# EAGLE design DotControl (EAGLE 7.7.0)

## Sheet 1 of 2
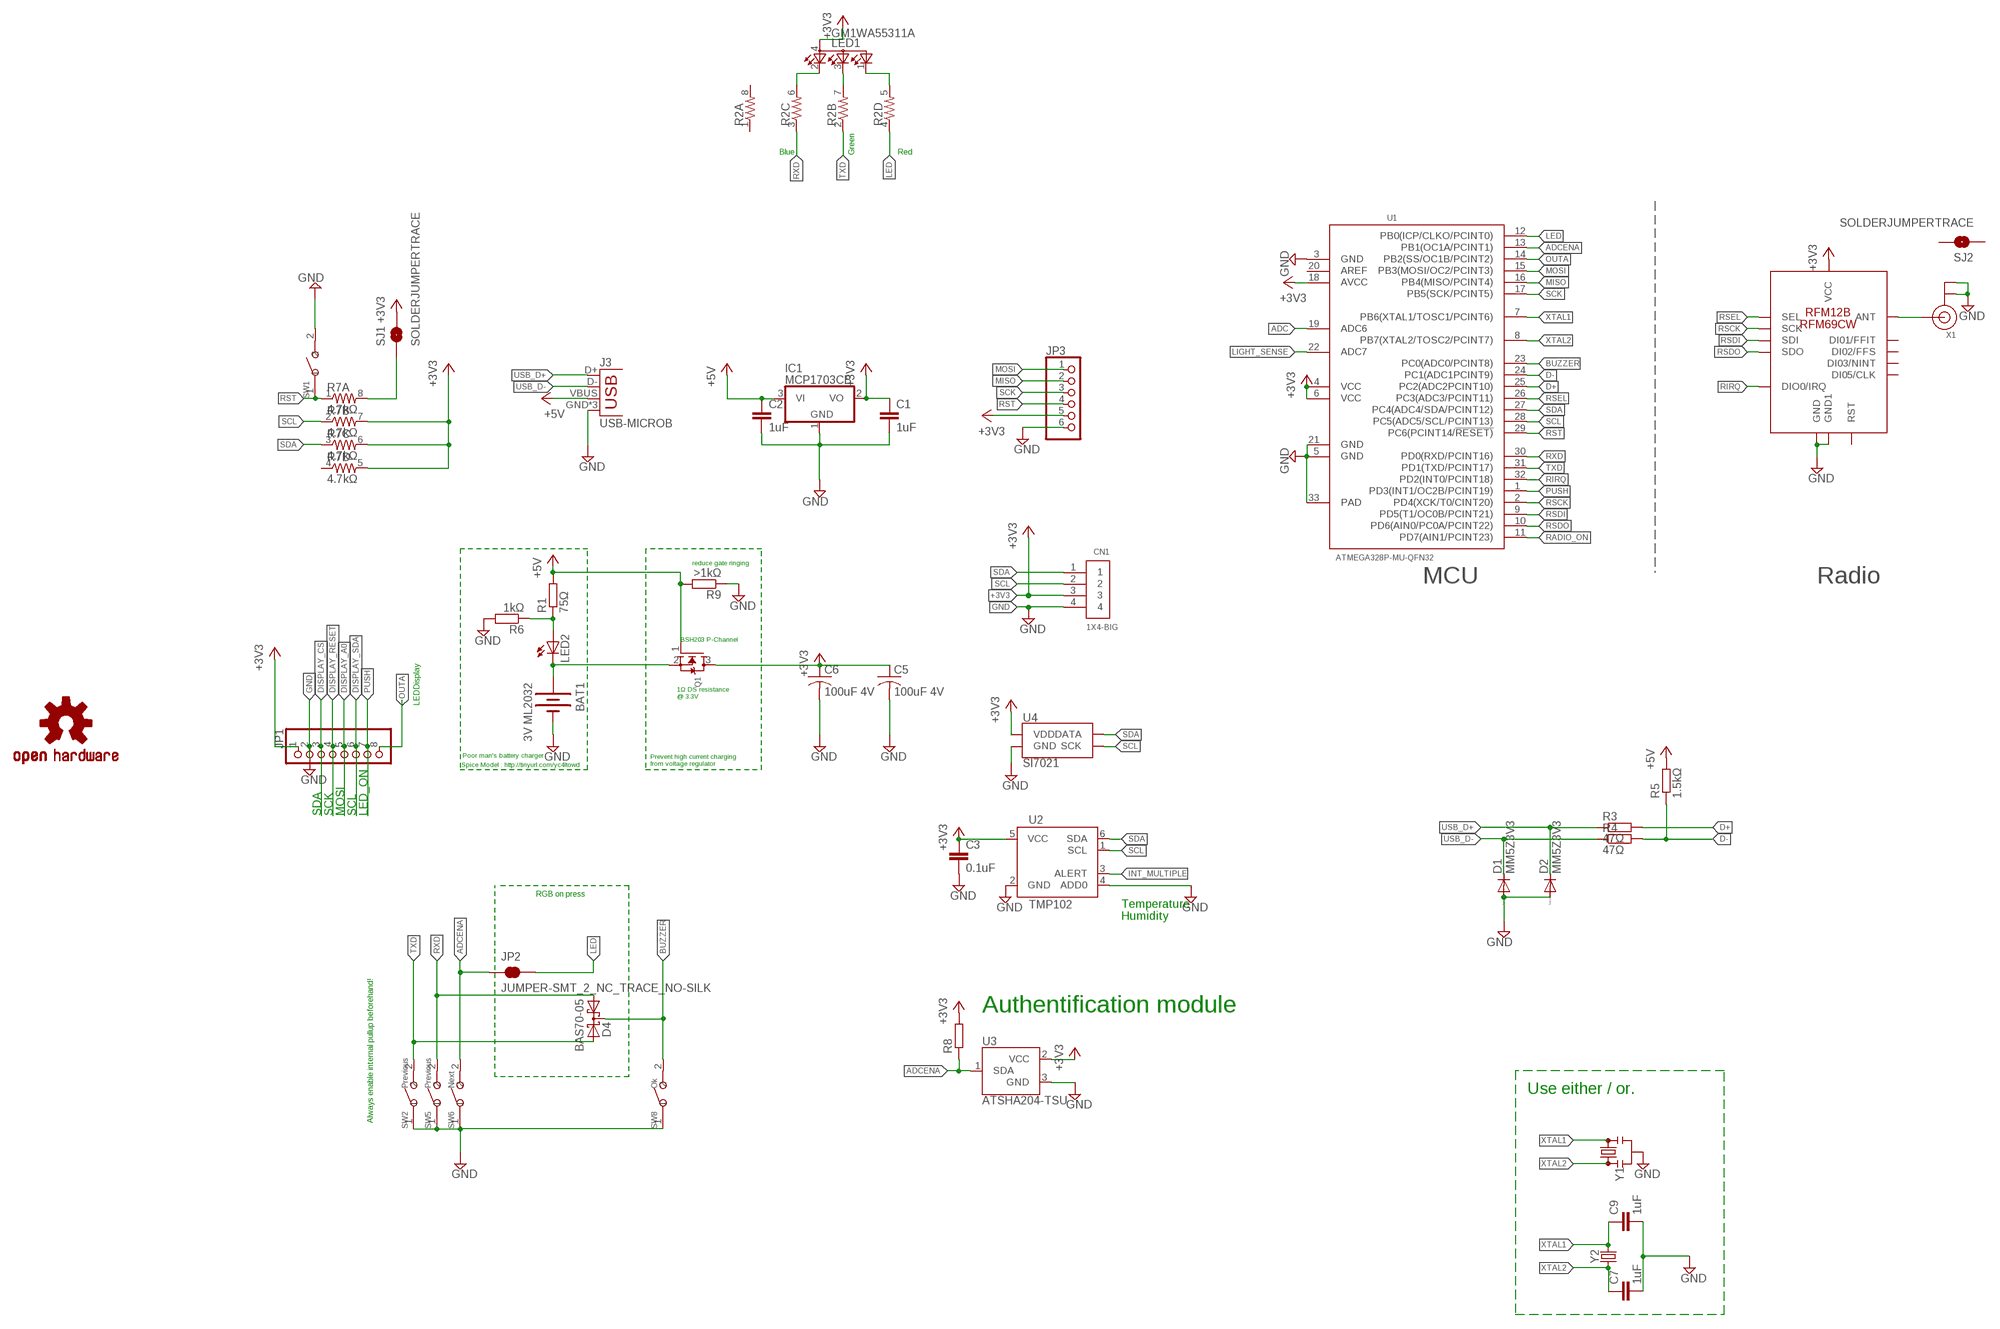
[diagram p0: schematic, sheet 1, part 1 of 2]
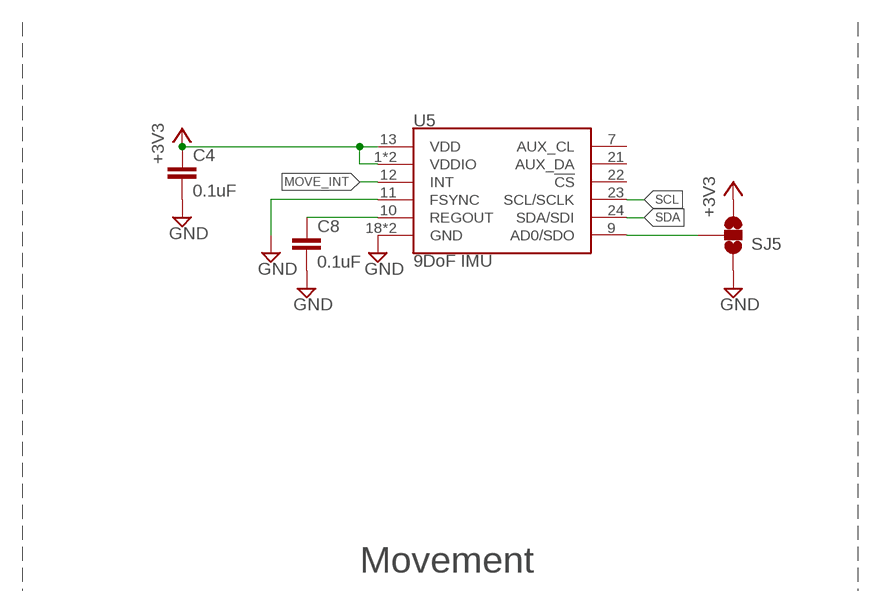
[diagram p1: schematic, sheet 1, part 2 of 2]

### Parts
BAT1  3V ML2032  BATTERY20PTH  [BATTCOM_20MM_PTH]
C1  1uF  C-EUC0603  [C0603]
C2  1uF  C-EUC0603  [C0603]
C3  0.1uF  C-EUC0603  [C0603]
C4  0.1uF  C-EUC0603  [C0603]
C5  100uF 4V  C-USC3216  [C3216]
C6  100uF 4V  C-USC3216  [C3216]
C7  1uF  C-EUC0603  [C0603]
C8  0.1uF  C-EUC0603  [C0603]
C9  1uF  C-EUC0603  [C0603]
CN1  1X4-BIG  [1X04-BIG]
D1  MM5Z3V3  DIODE-SOD523  [SOD523]
D2  MM5Z3V3  DIODE-SOD523  [SOD523]
D4  BAS70-05  [SOT23]
IC1  MCP1703CB  [SOT23]
J3  USB-MICROB  [USB-MICROB]
JP1  PINHD-1X8CLEANBIG  [1X08-CLEANBIG]
JP2  JUMPER-SMT_2_NC_TRACE_NO-SILK  [SMT-JUMPER_2_NC_TRACE_NO-SILK]
JP3  PINHD-1X6  [1X06]
LED1  GM1WA55311A  [GM1WA55311A]
LED2  LED0603  [LED-0603]
Q1  MOSFET-NREFLOW  [SOT23]
R1  75Ω  R-EU_R0603  [R0603]
R2  RESISTOR-ARRAY0603-ARV  [0603-ARV]
R3  47Ω  R-EU_R0603  [R0603]
R4  47Ω  R-EU_R0603  [R0603]
R5  1.5kΩ  R-EU_R0603  [R0603]
R6  1kΩ  R-EU_R0603  [R0603]
R7  4.7kΩ  RESISTOR-ARRAY0603-ARV  [0603-ARV]
R8  R-EU_R0603  [R0603]
R9  >1kΩ  R-EU_R0603  [R0603]
SJ1  SOLDERJUMPERTRACE  [SJ_2S-TRACE]
SJ2  SOLDERJUMPERTRACE  [SJ_2S-TRACE]
SJ5  SOLDERJUMPER_2WAYS  [SJ_3]
SW1  SMD-BUTTON(2P-6.0X3.0X2.5MM)-DHT-1163S  [SW2-4.0-6.0X3.0X2.5MM]
SW2  Previous  SMD-BUTTON(2P-6.0X3.0X2.5MM)-DHT-1163S  [SW2-4.0-6.0X3.0X2.5MM]
SW5  Previous  SMD-BUTTON(2P-6.0X3.0X2.5MM)-DHT-1163S  [SW2-4.0-6.0X3.0X2.5MM]
SW6  Next  SMD-BUTTON(2P-6.0X3.0X2.5MM)-DHT-1163S  [SW2-4.0-6.0X3.0X2.5MM]
SW8  Ok  SMD-BUTTON(2P-6.0X3.0X2.5MM)-DHT-1163S  [SW2-4.0-6.0X3.0X2.5MM]
U1  ATMEGA328P-MU-QFN32  MCU-ATMEGA328P-MU(QFN32)  [QFN32G-0.5-5X5MM]
U2  TMP102  [SOT563]
U3  ATSHA204-TSU  [SOT23-3]
U4  SI7021  [DFN-6-3X3-SI7021]
U5  9DoF IMU  MPU-9250  [QFN24-3X3]
U$1  RFM12B/69CW  [RFM12B/69CW]
U$2  OSHW-LOGOL  [OSHW-LOGO-L]
X1  ANTENNA_U.FL  [U.FL]
Y1  RESONATORSMD-3.2X1.3  [RESONATOR-SMD-3.2X1.3]
Y2  CRYSTALSMD-3.2X1.5  [CRYSTAL-SMD-3.2X1.5MM]

### Nets
+3V3: C1.1 C3.1 C4.1 C5.1 C6.1 CN1.3 IC1.2(VO) JP1.1 JP3.5 LED1.4(A) Q1.3(D) R7.5 R7.6 R7.7 R8.2 SJ1.2 SJ5.3 U1.4(VCC) U1.6(VCC) U1.18(AVCC) U2.5(VCC) U3.2(VCC) U4.VDD U5.1(VDDIO) U5.8(VDDIO) U5.13(VDD) U$1.VDD(VCC)
+5V: C2.1 IC1.3(VI) J3.VBUS Q1.1(G) R1.2 R5.2 R9.2
ADC: U1.19(ADC6)
ADCENA: JP2.1 R8.1 SW6.2 U1.13(PB1(OC1A/PCINT1)) U3.1(SDA)
BLUE: LED1.2(CRED) R2.6
BUZZER: D4.3(C) SW8.2 U1.23(PC0(ADC0/PCINT8))
D+: R3.2 U1.25(PC2(ADC2PCINT10))
D-: R4.2 R5.1 U1.24(PC1(ADC1PCINT9))
DISPLAY_A0: JP1.5
DISPLAY_CS: JP1.3
DISPLAY_RESET: JP1.4
DISPLAY_SDA: JP1.6
GND: BAT1.2(-) C1.2 C2.2 C3.2 C4.2 C5.2 C6.2 C7.2 C8.2 C9.2 CN1.4 D1.A D2.A IC1.1(GND) J3.GND J3.MT1(GND) J3.MT2(GND) JP1.2 JP3.6 R6.2 R9.1 SJ5.1 SW1.2 SW2.1 SW5.1 SW6.1 SW8.1 U1.3(GND) U1.5(GND) U1.21(GND) U1.33(PAD) U2.2(GND) U2.4(ADD0) U3.3(GND) U4.GND U5.11(FSYNC) U5.18(GND) U5.20(GND) U$1.GND U$1.GND1 X1.1(GND) X1.2(GND) Y1.2
GREEN: LED1.3(CBLUE) R2.7
INT_MULTIPLE: U2.3(ALERT)
LED: JP2.2 R2.4 U1.12(PB0(ICP/CLKO/PCINT0))
LIGHT_SENSE: U1.22(ADC7)
MISO: JP3.2 U1.16(PB4(MISO/PCINT4))
MOSI: JP3.1 U1.15(PB3(MOSI/OC2/PCINT3))
MOVE_INT: U5.12(INT)
N$1: LED2.A R1.1 R6.1
N$2: R7.8 SJ1.1
N$3: U$1.ANT X1.3(SIGNAL)
N$10: SJ5.2 U5.9(AD0/SDO)
N$15: C8.1 U5.10(REGOUT)
N$18: BAT1.1(+) LED2.C Q1.2(S)
OUTA: JP1.8 U1.14(PB2(SS/OC1B/PCINT2))
PUSH: JP1.7 U1.1(PD3(INT1/OC2B/PCINT19))
RADIO_ON: U1.11(PD7(AIN1/PCINT23))
RED: LED1.1(CGREEN) R2.5
RIRQ: U1.32(PD2(INT0/PCINT18)) U$1.IRQ(DIO0/IRQ)
RSCK: U1.2(PD4(XCK/T0/CINT20)) U$1.SCK
RSDI: U1.9(PD5(T1/OC0B/PCINT21)) U$1.SDI
RSDO: U1.10(PD6(AIN0/PC0A/PCINT22)) U$1.SDO
RSEL: U1.26(PC3(ADC3/PCINT11)) U$1.SEL
RST: JP3.4 R7.1 SW1.1 U1.29(PC6(PCINT14/!RESET))
RXD: D4.1(A1) R2.3 SW5.2 U1.30(PD0(RXD/PCINT16))
SCK: JP3.3 U1.17(PB5(SCK/PCINT5))
SCL: CN1.2 R7.2 U1.28(PC5(ADC5/SCL/PCINT13)) U2.1(SCL) U4.SCK U5.23(SCL/SCLK)
SDA: CN1.1 R7.3 U1.27(PC4(ADC4/SDA/PCINT12)) U2.6(SDA) U4.DATA U5.24(SDA/SDI)
TXD: D4.2(A2) R2.2 SW2.2 U1.31(PD1(TXD/PCINT17))
USB_D+: D2.C J3.D+ R3.1
USB_D-: D1.C J3.D- R4.1
XTAL1: C9.1 U1.7(PB6(XTAL1/TOSC1/PCINT6)) Y1.3 Y2.P$2
XTAL2: C7.1 U1.8(PB7(XTAL2/TOSC2/PCINT7)) Y1.1 Y2.P$1
Unconnected: R2.1 R2.8 R7.4 SJ2.1 SJ2.2 U1.20(AREF) U5.7(AUX_CL) U5.21(AUX_DA) U5.22(!CS) U$1.CLK(DI05/CLK) U$1.FFIT(DI01/FFIT) U$1.FFS(DI02/FFS) U$1.NINT(DI03/NINT) U$1.RST

### Notes on the sheet
- Blue | Green | Red
- reduce gate ringing
- Movement
- MCU | Radio
- BSH203 P-Channel
- 1Ω DS resistance 
  @ 3.3V
- LEDDisplay
- Poor man's battery charger
- Prevent high current charging 
  from voltage regulator
- Spice Model : http://tinyurl.com/yc4ltowd
- SDA | SCK | MOSI | SCL | LED_ON
- RGB on press
- Temperature
  Humidity
- Authentification module
- Use either / or.
- Always enable internal pullup beforehand!

## Sheet 2 of 2
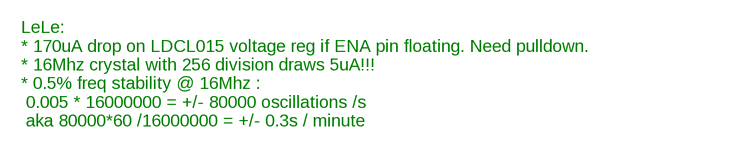
[diagram p2: schematic, sheet 2]

### Notes on the sheet
- LeLe: 
  * 170uA drop on LDCL015 voltage reg if ENA pin floating. Need pulldown.
  * 16Mhz crystal with 256 division draws 5uA!!!
  * 0.5% freq stability @ 16Mhz : 
   0.005 * 16000000 = +/- 80000 oscillations /s
   aka 80000*60 /16000000 = +/- 0.3s / minute

## Library data of the parts
BAT1 = Battery:BATTERY: Battery Holders Various common sizes : AA, AAA, 20mm coin cell and 12mm coin cell.
C1 C2 C7 C9 = rcl:C-EU: CAPACITOR, European symbol
C3 C4 C8 = resistor:C-EU: CAPACITOR, European symbol
C5 C6 = adafruit:C-US: CAPACITOR, American symbol
CN1 = adafruit:1X4: 4-pin connector
D1 D2 = diode:DIODE-: DIODE
D4 = diode:BAS70-05: Silicon Schottky Diodes General-purpose diode for high-speed switching
IC1 = linear:MCP1703: 250 mA, 16V, Low Quiescent Current LDO Regulator Source: http://ww1.microchip.com/downloads/en/DeviceDoc/22049b.pdf
J3 = SparkFun-Retired:USB: USB Connectors USB-B-PTH is fully proven SKU : PRT-00139/CONN-08278 USB-miniB is fully proven SKU : PRT-00587 USB-A-PCB is untested. USB-A-H is throughly reviewed, but untested. Spark Fun Electronics SKU : PRT-00437 USB-B-SMT is throughly reviewed, but untested. Needs silkscreen touching up. USB-A-S has not been used/tested USB-MB-H has not been used/tested USB-MICROB has been used. CONN-09505; PROD_ID: CONN-09505
JP1 = adafruit:PINHD-1X8: PIN HEADER
JP2 = SparkFun-Jumpers:JUMPER-SMT_2_NC_TRACE: Normally closed trace jumper This jumper has a trace between two pads so it's normally closed (NC). Use a razor knife to open the connection. For best results follow the IPC guidelines for cutting traces: Cutout at least 0.063 mm (0.005 in). Remove all loose material to clean up the cut area. Seal the cut with an approved epoxy. Reapply solder to reclose the connection.
JP3 = adafruit:PINHD-1X6: PIN HEADER
LED1 = led:GM1WA55311A: Chip LED RGB Source: http://document.sharpsma.com/files/GM1WA55311A_SS.pdf
LED2 = SparkFun:LED: LEDs Standard schematic elements and footprints for 5mm, 3mm, 1206, and 0603 sized LEDs. 5mm - Spark Fun Electronics SKU : COM-00529 (and others)
Q1 = adafruit:MOSFET-N: N-Channel Mosfet 2N7002E - 60V 260mA SOT23 [Digikey: 2N7002ET1GOSTR-ND] - REEL BSH103 - 30V 850mA SOT23 [Digikey: 568-5013-1-ND]
R1 R6 R9 = resistor:R-EU_: RESISTOR, European symbol
R2 R7 = SparkFun:RESISTOR-ARRAY: Array Chip Resistor Source: RS Component / Phycomp
R3-R5 R8 = rcl:R-EU_: RESISTOR, European symbol
SJ1 SJ2 = SparkFun:SOLDERJUMPER: Solder Jumper Standard SMD solder jumper. Used to automate production. Two varients : Normally Open and Normally Closed are the same, but have different paste layers. NC will have a large amount of paste and should jumper during reflow.
SJ5 = SparkFun:SOLDERJUMPER_2WAY: Solder Jumper 2 way solder jumper
SW1 SW2 SW5 SW6 SW8 = Seeed-OPL-Switch:SMD-BUTTON(2P-6.0X3.0X2.5MM): 311020029
U1 = Seeed-OPL-ic:MCU-ATMEGA328P-MU(QFN32): 310010005; MPN: ATMEGA328P-MU
U2 = SparkFun:TMP102
U3 = SparkFun-IC-Special-Function:ATSHA204: Atmel ATSHA204 The Atmel ATSHA204 is an optimized authentication chip that includes a 4.5Kb EEPROM. This array can be used for storage of keys, miscellaneous read/write, read-only, password or secret data, and consumption tracking. Access to the various sections of memory can be restricted in a variety of ways and then the configuration locked to prevent changes. Datasheet <http://www.atmel.com/Images/Atmel-8740-CryptoAuth-ATSHA204-Datasheet.pdf> SparkFun Products SparkFun Electric Imp Shield <https://www.sparkfun.com/products/12887> SparkFun Electric Imp Breakout <https://www.sparkfun.com/products/12886>; PROD_ID: IC-11208
U4 = SparkFun-Sensors:SI7021: Silicon Labs Si7021 I2C Humidity and Temperature Sensor The Si7021 is a low-cost, easy-to-use, highly accurate, digital humidity and temperature sensor. This sensor is ideal for environmental sensing and data logging and perfect for build a weather stations or humidor control system. All you need are two lines for I2C communication, and you’ll have relative humidity readings and very accurate temperature readings as a bonus! Datasheet <https://cdn.sparkfun.com/datasheets/Sensors/Weather/Si7021.pdf> SparkFun Products SparkFun Humidity and Temperature Sensor Breakout - Si7021 <https://www.sparkfun.com/products/13763> (SEN-13763) SparkFun Blynk Board - ESP8266 <https://www.sparkfun.com/products/13794> (WRL-13794); PROD_ID: IC-13093
U5 = SparkFun-Sensors:MPU-9250: MPU-9250 9 Degree of Freedom IMU System in Package that contains MPU-6500 & AK8963 NC pin 19. 2-6 & 14-17 not internally connected. May be used for PCB trace routing. Datasheet <https://cdn.sparkfun.com/assets/learn_tutorials/5/5/0/MPU9250REV1.0.pdf> SparkFun Products: SparkFun 9DoF Razor IMU M0 <https://www.sparkfun.com/products/14001> SparkFun IMU Breakout - MPU-9250 <https://www.sparkfun.com/products/13762>; PROD_ID: IC-13192
U$1 = rfm12b_withoutPlanes:RFM12B/69CW
U$2 = SparkFun:OSHW-LOGO: Open Source Hardware Logo This logo indicates the piece of hardware it is found on incorporates a OSHW license and/or adheres to the definition of open source hardware found here: http://freedomdefined.org/OSHW
X1 = adafruit:ANTENNA_U.FL: U.FL Antenna Connector
Y1 = SparkFun-Clocks:RESONATOR: Resonators (Generic) Ceramic resonators are clock-generating components, often used to control timing in microcontrollers. They usually have 3 pins: two pins for oscillation, and one pin for ground. Compared to crystals, resonators have worse tolerance, but are usually much cheaper. Plus, they have built-in load capacitors! These devices are used on boards like the Arduino Pro 8MHz <https://www.sparkfun.com/products/11114> and Arduino Pro 16MHz <https://www.sparkfun.com/products/11113>.
Y2 = SparkFun-Clocks:CRYSTAL: Crystals (Generic) These are passive quartz crystals, which can be used as a clock source for a microcontroller. Crystal's are two-terminal devices. They require external "load" capacitors to generate an oscillating signal.

## Board
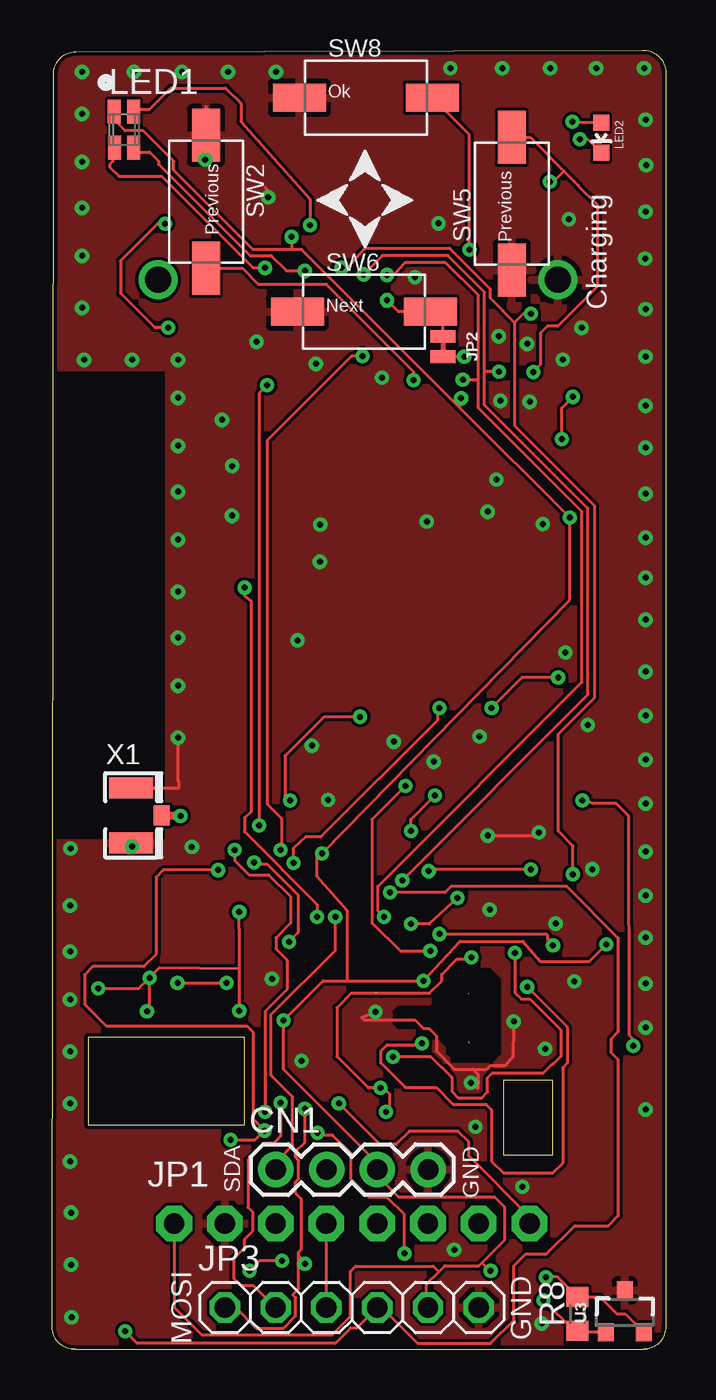
[diagram p3: board, top side]
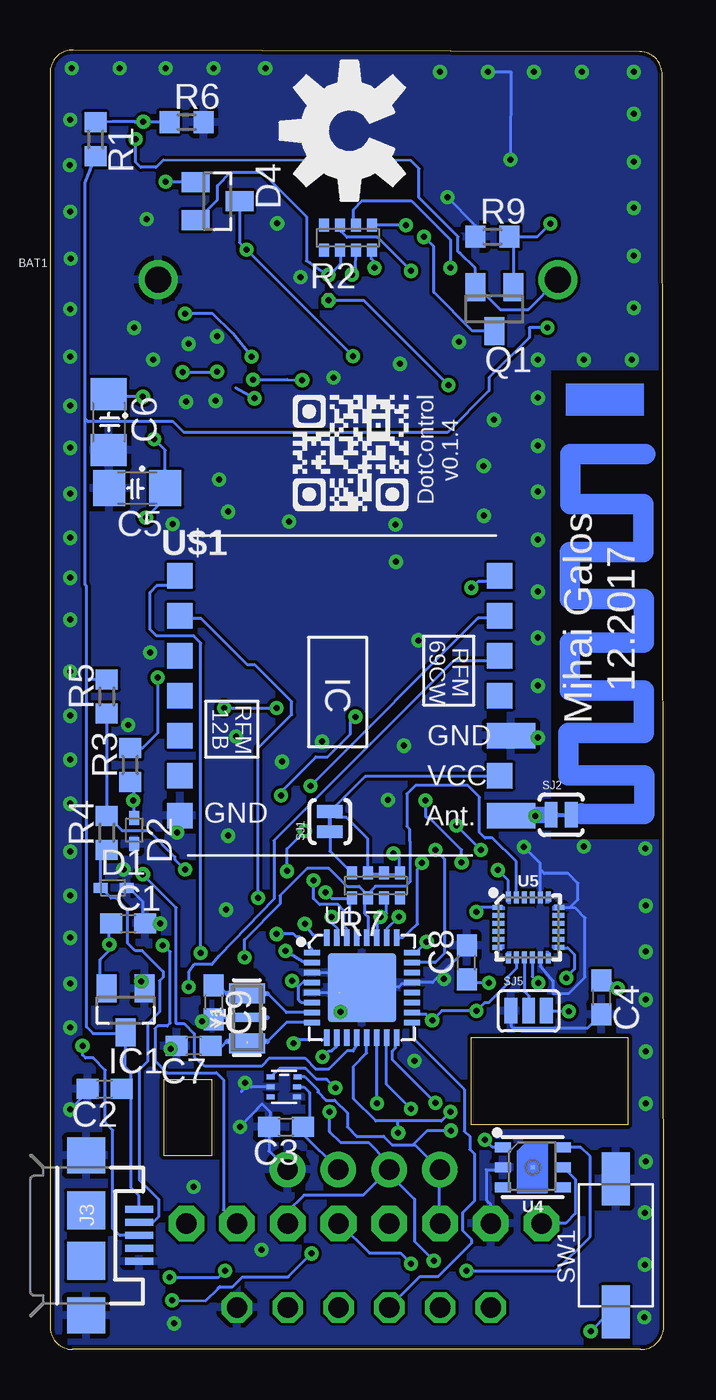
[diagram p4: board, bottom side, seen from below]

Size 30.71 x 65 mm. Coordinates in mm from the lower left corner, seen from the top.
Outline: 1.17,0 29.59,0 arc90 30.71,1.17 30.71,63.88 arc90 29.54,65 1.19,64.92 arc90 0.08,63.75 0,1.12 arc90 1.17,0
Outline: 22.6,13.49 25.03,13.49 25.03,9.7 22.6,9.7 22.6,13.49
Outline: 9.63,15.6 1.8,15.6 1.8,11.23 9.63,11.23 9.63,15.6
Copper layers (1*16): Top 0.035mm / dielectric 1.5mm / Bottom 0.035mm
Design rules "Mihai_default": minimum track width 6mil, minimum drill 0.3mm, track to track 6mil, track to pad 6mil, pad to pad 6mil, via to via 6mil, smd to smd 6mil, copper to edge 8mil, drill to drill 8mil, minimum pad ring 10mil, minimum via ring 8mil, stop-mask expansion 4mil, vias tented up to drill 0mil, thermal gap 10mil
tRestrict: area 17.1,14.4 to 22.4,19; area 0.2,25.5 to 5.6,48.9
bRestrict: area 17.1,14.4 to 22.4,19; area 0.2,25.5 to 5.6,49

### Footprints (pad centres in the part's own frame; a part is rotated, then mirrored left to right if it is on the bottom)
BATTCOM_20MM_PTH = drill 1.3: 1 20,0; 2 0,0
C0603 = smd 1.1 x 1: 1 -0.85,0; 2 0.85,0
C3216 = smd 1.6 x 1.8: 1 -1.4,0; 2 1.4,0
1X04-BIG = drill 1.016 pad 1.778: 1 0,0; 2 2.54,0; 3 5.08,0; 4 7.62,0
SOD523 = smd 0.7 x 0.5: A 0.7,0; C -0.6,0
SOT23 = smd 1 x 1.4: 1 -0.95,-1.1; 2 0.95,-1.1; 3 0,1.1
USB-MICROB = smd 0.35 x 1.4: D+ 0,2.65; D- -0.65,2.65; GND 1.3,2.65; ID 0.65,2.65; VBUS -1.3,2.65 | smd 1.8 x 1.9: MT1 -4,0; MT2 4,0 | smd 1.9 x 1.9: P$1 -1.27,0; P$2 1.27,0
1X08-CLEANBIG = drill 1.016 pad 1.778 octagon: 1 -8.89,0; 2 -6.35,0; 3 -3.81,0; 4 -1.27,0; 5 1.27,0; 6 3.81,0; 7 6.35,0; 8 8.89,0
SMT-JUMPER_2_NC_TRACE_NO-SILK = smd 0.635 x 1.27: 1 -0.508,0; 2 0.508,0
1X06 = drill 1.016 octagon: 1 -6.35,0; 2 -3.81,0; 3 -1.27,0; 4 1.27,0; 5 3.81,0; 6 6.35,0
GM1WA55311A = smd 0.65 x 1.2: 1 0.477,0.9; 2 -0.475,-0.9; 3 0.475,-0.9; 4 -0.477,0.9
LED-0603 = smd 0.8 x 0.8: A 0,-0.75; C 0,0.75
R0603 = smd 1 x 1.1: 1 -0.85,0; 2 0.85,0
0603-ARV = smd 0.5 x 0.65: 1 -1.2,-0.625; 2 -0.4,-0.625; 3 0.4,-0.625; 4 1.2,-0.625; 5 1.2,0.625; 6 0.4,0.625; 7 -0.4,0.625; 8 -1.2,0.625
SJ_2S-TRACE = smd 0.635 x 1.27: 1 -0.508,0; 2 0.508,0
SJ_3 = smd 0.635 x 1.27: 1 -0.889,0; 2 0,0; 3 0.889,0
SW2-4.0-6.0X3.0X2.5MM = smd 2.65 x 1.4: 1 -3.325,0; 2 3.325,0
QFN32G-0.5-5X5MM = smd 0.813 x 0.279: 1 -2.5,1.75; 2 -2.5,1.25; 3 -2.5,0.75; 4 -2.5,0.25; 5 -2.5,-0.25; 6 -2.5,-0.75; 7 -2.5,-1.25; 8 -2.5,-1.75; 17 2.5,-1.75; 18 2.5,-1.25; 19 2.5,-0.75; 20 2.5,-0.25; 21 2.5,0.25; 22 2.5,0.75; 23 2.5,1.25; 24 2.5,1.75 | smd 0.279 x 0.813: 9 -1.75,-2.5; 10 -1.25,-2.5; 11 -0.75,-2.5; 12 -0.25,-2.5; 13 0.25,-2.5; 14 0.75,-2.5; 15 1.25,-2.5; 16 1.75,-2.5; 25 1.75,2.5; 26 1.25,2.5; 27 0.75,2.5; 28 0.25,2.5; 29 -0.25,2.5; 30 -0.75,2.5; 31 -1.25,2.5; 32 -1.75,2.5 | smd 3.429 x 3.429: 33 0,0
SOT563 = smd 0.25 x 0.4: 1 -0.5,-0.66; 2 0,-0.66; 3 0.5,-0.66; 4 0.5,0.66; 5 0,0.66; 6 -0.5,0.67
SOT23-3 = smd 0.8 x 0.9: 1 -0.95,-1; 2 0.95,-1; 3 0,1.1
DFN-6-3X3-SI7021 = smd 0.2 x 0.2: 7 0,0 | smd 0.8 x 0.5: DATA 1.5,-1; GND 1.5,0; NC@3 1.5,1; NC@4 -1.5,1; SCK -1.5,-1; VDD -1.5,0
QFN24-3X3 = smd 0.495 x 0.25: 1 -1.552,1; 6 -1.552,-1; 13 1.552,-1; 18 1.552,1 | smd 0.6 x 0.25: 2 -1.5,0.6; 3 -1.5,0.2; 4 -1.5,-0.2; 5 -1.5,-0.6; 14 1.5,-0.6; 15 1.5,-0.2; 16 1.5,0.2; 17 1.5,0.6 | smd 0.25 x 0.495: 7 -1,-1.552; 12 1,-1.552; 19 1,1.552; 24 -1,1.552 | smd 0.25 x 0.6: 8 -0.6,-1.5; 9 -0.2,-1.5; 10 0.2,-1.5; 11 0.6,-1.5; 20 0.6,1.5; 21 0.2,1.5; 22 -0.2,1.5; 23 -0.6,1.5
RFM12B/69CW = smd 2.413 x 1.27: ANT 9.06,-6; GND 9.06,-2 | smd 1.27 x 1.27: CLK -7.5,-2; FFIT -7.5,0; FFS -7.5,2; GND1 -7.5,-6; IRQ -7.5,4; NINT 8.5,0; RST -7.5,-4; SCK 8.5,4; SDI 8.5,2; SDO -7.5,6; SEL 8.5,6; VDD 8.5,-4
U.FL = smd 2.2 x 1.05: 1 0,1.375; 2 0,-1.375 | smd 0.8 x 1: 3 1.525,0
RESONATOR-SMD-3.2X1.3 = smd 0.45 x 1.905: 1 -1.2,0; 2 0,0; 3 1.2,0
CRYSTAL-SMD-3.2X1.5MM = smd 1 x 1.8: P$1 -1.25,0; P$2 1.25,0

### Placement (x,y rotation side)
BAT1  25.3,53.5 0 bottom
C1  26.8,21.3 0 bottom
C2  27.97,13.03 180 bottom
C3  18.9,11.13 180 bottom
C4  3.12,17.6 270 bottom
C5  26.34,43.08 180 bottom
C6  27.76,46.38 270 bottom
C7  23.52,15.19 180 bottom
C8  9.86,19.35 90 bottom
C9  22.53,17.37 270 bottom
CN1  11.2,9 0 top
D1  27.56,23.09 0 bottom
D2  26.49,25.98 270 bottom
D4  22.33,57.43 270 bottom
IC1  26.92,16.97 180 bottom
J3  28.9,5.7 270 bottom
JP1  15,6.3 0 top
JP2  19.56,50.16 270 top
JP3  15,2.1 0 top
LED1  3.6,61 0 top
LED2  27.48,60.6 180 top
Q1  8.48,52.04 180 bottom
R1  28.42,60.53 270 bottom
R2  15.8,55.6 0 bottom
R3  26.7,29.24 90 bottom
R4  27.86,25.83 90 bottom
R5  27.86,32.66 90 bottom
R6  23.88,61.39 0 bottom
R7  14.4,23.2 0 bottom
R8  26.29,1.78 90 top
R9  8.56,55.65 0 bottom
SJ1  16.7,26.4 90 bottom
SJ2  5.13,26.75 0 bottom
SJ5  6.76,16.94 0 bottom
SW1  2.4,5.2 90 bottom
SW2  7.7,57.4 270 top
SW5  23,57.3 90 top
SW6  15.6,51.9 0 top
SW8  15.7,62.61 0 top
U1  15.1,18.1 0 bottom
U2  19,13.13 270 bottom
U3  28.65,1.85 0 top
U4  6.55,9.12 180 bottom
U5  6.78,21.11 0 bottom
U$1  16.7,32.7 0 bottom
U$2  15.72,60.96 90 bottom
X1  3.96,26.72 0 top
Y1  20.85,16.6 90 bottom
Y2  20.85,16.56 90 bottom

### Tracks (layer width: path | path; a pad name or v marks a point on that pad's centre or on a via)
+3V3  (via drill 0.3)
  Top 0.152: 12.04,55.02 12.5,55.02 20.42,47.09 | 12.04,55.02 10.06,55.02 6.1,58.98 6.1,59.44 4.57,60.96 3.66,60.96 3.2,61.42 3.2,61.87 LED1.4 | 20.42,47.09 v25.91,41.6 25.91,37.49 v13.51,24.82 13.26,24.59 13.26,23.67 14.78,21.95 14.78,18.44 | CN1.3 16.15,9.14 16.15,9.45 11.58,14.02 v11.58,16.46 13.56,18.44 14.78,18.44 | 14.78,18.44 v18.59,18.44 20.42,20.42 23.57,20.42 24.43,19.41 26.87,19.41 v27.74,20.27 | 16.31,8.69 16.31,8.99 CN1.3 | JP3.5 18.75,2.13 18.75,3.28 19.36,3.89 | 19.36,3.89 19.66,4.19 21.36,4.19 21.51,4.34 | 21.51,4.34 22.66,5.49 22.66,7.11 22.15,7.62 17.35,7.62 16.28,8.69 CN1.3 | JP1.1 6.11,2.12 7.49,0.74 14.02,0.74 14.94,1.65 14.94,3.91 15.19,4.17 19.07,4.17 19.36,3.89 | v24.71,3.61 24.77,3.66 25.26,3.66 R8.2 27.42,2.63 28.27,1.78 28.68,1.78 U3.2 | v21.95,3.94 21.92,3.94 21.51,4.34 | 9.37,19.05 v9.37,16.94 | v4.88,18.59 5.38,19.1 9.37,19.05 | v4.75,16.92 4.88,16.92 v4.88,18.59 | v2.31,18.06 4.34,18.06 v4.88,18.59 | 9.37,21.03 | 9.37,21.03 v9.37,21.89 | v11.99,55.65 11.99,55.07 12.04,55.02 | 9.37,21.03 9.37,19.05 | v20.47,47.57 20.37,47.45 20.42,47.09 | v25.5,45.54 25.5,47.09 v26.06,47.65
  Bottom 0.152: v13.51,24.82 13.26,24.61 13.26,23.93 R7.5 13.26,23.77 13.87,23.77 R7.6 14.02,23.77 14.78,23.77 R7.7 14.8,25.54 15.88,26.62 16.41,26.62 SJ1.2 14.96,28.65 8.23,28.65 U$1.VDD | C1.1 27.74,21.18 v27.74,20.27 27.74,19.96 28.19,19.51 28.19,18.16 IC1.2 | 18.29,18.14 18.29,17.53 18.14,17.37 17.68,17.37 U1.6 | 18.29,18.14 17.98,18.44 17.83,18.29 17.68,18.29 U1.4 | U1.18 12.5,16.76 11.89,16.76 v11.58,16.46 11.1,16.94 v9.37,16.94 8.97,17.35 8.76,17.35 7.82,18.29 7.82,18.62 7.38,19.06 U5.8 | v18.59,18.44 18.29,18.14 | CN1.3 18.05,10.77 C3.1 17.73,11.44 17.73,12.85 18.01,13.13 U2.5 | v24.71,3.61 22.28,3.61 v21.95,3.94 | U4.VDD 5.03,9.12 4.42,8.51 4.42,6.81 4.9,6.33 6.08,6.33 JP1.1 | U5.1 9.16,22.11 v9.37,21.89 | U5.13 5.21,20.09 4.8,20.09 4.47,19.76 4.47,19.02 4.88,18.62 v4.88,18.59 | C4.1 3.12,18.54 2.79,18.54 v2.31,18.06 | SJ5.3 4.75,16.94 v4.75,16.92 | Q1.3 9.57,50.95 11.51,52.88 11.51,55.17 v11.99,55.65 | 21.41,48.11 v20.47,47.57 | v25.91,41.6 24.94,42.57 C5.1 24.94,44.98 v25.5,45.54 | v26.06,47.65 27.63,47.65 C6.1
+5V  (via drill 0.3)
  Top 0.152: v5.66,56.31 5.28,56.31 3.43,54.46 3.43,52.83 5.13,51.13 5.79,51.13 v5.82,51.1
  Bottom 0.152: 28.88,33.43 28.88,16.13 28.55,15.8 27.37,15.8 arc-90 IC1.3 26.95,14.15 26.64,13.84 26.64,13.03 | 28.88,33.43 28.88,38.18 28.96,38.25 28.96,46.56 | 28.96,46.56 28.96,58.36 R1.2 | R5.2 28.79,33.51 28.88,33.43 | J3.VBUS 26.25,7.68 26.64,8.08 26.64,13.03 | Q1.1 7.53,55.65 R9.2 6.33,55.65 v5.66,56.31 | v5.82,51.1 6.73,51.1 6.73,50.62 8.74,48.62 8.74,47.95 10.82,45.87 24,45.87 24.54,46.41 28.8,46.41 28.96,46.56 | C2.1 26.64,13.03
ADCENA  (via drill 0.3)
  Top 0.152: v10.36,26.21 10.36,47.83 v10.77,48.23 | v17.63,4.8 17.63,6.76 16.76,7.62 15.85,7.62 14.96,8.51 14.96,9.8 14.05,10.72 13.41,10.72 v13.28,10.85 | 10.62,11.94 v10.67,11.89 10.67,16.92 11.76,18.01 11.76,19.48 11.2,20.04 11.2,20.6 11.94,21.34 11.94,22.66 10.85,23.75 9.86,23.75 9.14,24.46 v9.14,24.99 | v16.76,52.48 17.34,51.9 SW6.2 19.56,51.27 JP2.1 | U3.1 26.36,0.85 R8.1 26.12,0.93 v24.59,2.46
  Bottom 0.152: 13.28,11.43 11.12,11.43 v10.67,11.89 | 13.28,11.43 14.4,11.43 15.52,12.55 15.52,14.17 14.86,14.83 14.86,15.57 | v10.36,26.21 v9.14,24.99 | 14.86,15.57 U1.13 14.86,15.57 | v24.59,2.46 22.91,2.44 22.3,3.05 22.3,3.07 22.28,3.1 22.25,3.1 22.2,3.15 21.57,3.15 21.08,3.63 18.8,3.63 v17.63,4.8 | v13.28,10.85 13.28,11.43 | v16.76,52.48 15.01,52.48 v10.77,48.23
BLUE  (via drill 0.3)
  Top 0.152: v10.67,54.1 10.06,54.1 5.49,58.67 3.35,58.67 2.9,59.13 2.9,59.28 3.05,59.44 3.05,60.05 LED1.2
  Bottom 0.152: R2.6 15.54,56.24 15.54,57 15.09,57.45 12.62,57.45 10.67,55.5 v10.67,54.1
BUZZER  (via drill 0.3)
  Top 0.152: v15.54,49.68 14.99,49.68 10.77,45.47 10.77,27.28 11.48,26.57 11.48,25.04 v11.43,24.99 | v20.88,55.02 20.88,60.76 SW8.2
  Bottom 0.152: v11.43,24.99 10.97,24.54 10.97,19.81 11.43,19.36 12.5,19.36 U1.23 | v15.54,49.68 v20.88,55.02 21.23,55.36 D4.3
D+  (via drill 0.3)
  Top 0.152: v12.09,24.33 12.09,25.09 12.7,25.65 13.46,25.65 19.3,31.5 19.3,32 v19.38,32.08 | v25.32,33.6 23.52,33.6 v22,32.08
  Bottom 0.152: U1.25 13.05,20.6 12.32,21.29 12.32,24.03 v12.09,24.33 | 19.53,32.08 v19.38,32.08 v22,32.08 | R3.2 26.07,30.09 25.3,30.86 25.3,33.58 v25.32,33.6
D-  (via drill 0.3)
  Top 0.152: v23.95,24 18.87,24 18.87,23.95 v18.85,23.93 | v10.11,24.36 10.19,24.28 10.77,24.28 12.32,22.73 12.32,20.85 v11.86,20.4 | v17.96,25.93 17.96,26.52 v19.15,27.71 | v15.42,31.65 13.61,31.65 11.66,29.69 11.66,27.71 v11.91,27.46
  Bottom 0.152: R5.1 R4.2 27.82,26.68 27.1,25.96 25.78,25.96 24.46,24.64 24.46,24.51 v23.95,24 | U1.24 12.41,19.85 v11.86,20.4 | v10.11,24.36 10.11,24.99 11.71,26.59 11.84,26.59 11.91,26.67 v11.91,27.46 | v18.85,23.93 18.85,25.04 v17.96,25.93 | v19.15,27.71 19.15,27.89 17.4,29.64 16.82,29.64 15.67,30.79 15.67,31.39 v15.42,31.65
GND  (via drill 0.3)  (1 unrouted)
  Top 0.152: 22.89,16.61 v23.1,16.4 23.1,15.4 23.09,15.39 23.09,14.68 22.66,14.2 21.95,14.2 21.72,14.02 21.06,14.02 | v16.18,16.89 15.49,16.61 15.62,16.48 18.16,16.48 18.59,16.05 18.87,16.05 19.23,15.7 19.23,14.94 20.14,14.02 21.06,14.02 | v21.8,25.7 24.2,25.7 v24.36,25.86 | X1.1 6.35,28.1 6.35,28.42 6.3,28.42 v6.3,30.6 | v26.14,18.41 26.14,18.44 | v10.82,57.63 10.82,57.96 10.67,58.12 | v7.67,59.51 7.7,62.18 SW2.1 | 21.06,14.02 21.31,13.77 21.31,13.06 v20.95,13.34
  Bottom 0.152: U1.33 15.09,18.14 13.26,18.14 13.11,18.29 12.8,18.29 U1.21 11.57,18.35 9.86,20.07 C8.2 | 15.35,17.85 U1.33 | U1.3 15.85,18.85 U1.33 | Y1.2 22.9,16.6 v23.1,16.4 22.98,16.52 C9.2 | CN1.4 19.75,9.93 C3.2 19.7,11.89 20.09,12.28 v21.19,11.14 | 15.93,17.02 16.76,17.85 U1.5 16.26,17.85 15.44,17.04 | 16.18,17.02 16.18,17.83 17.48,17.83 17.48,17.86 | v16.18,16.89 15.44,17.04 | U2.4 18.29,12.58 | D1.A 26.75,23.09 26.06,22.4 26.06,21.41 C1.2 | U$1.GND1 24.36,26.7 v24.36,25.86 | JP1.2 8.65,7.25 8.84,7.44 8.84,8.94 8.89,8.99 8.18,8.99 U4.GND | U5.20 6.18,24 | 6.18,24 6.18,24.32 v7,25.13 | 6.18,24 5.98,23.8 4.78,23.8 4.29,23.32 4.29,22.5 4.69,22.11 U5.18 4.45,22.11 3.94,21.59 3.94,18.62 4.75,17.8 5.54,17.8 5.54,18.44 6.17,19.18 6.17,19.6 U5.11 | 7.75,17.09 7.75,16.94 SJ5.1 7.64,16.18 7.54,16.08 3.8,16.08 C4.2 | 19.83,16.6 19.84,16.61 22.63,16.61 | 15.44,17.04 15.1,17.04 U1.33 | IC1.1 26.28,18.27 arc90 v26.14,18.41 | R9.1 9.41,56.22 v10.82,57.63 | v8.8,63.9 7.64,63.9 v7.67,59.51 | C2.2 28.82,12.88 v29.7,12 | C7.2 24.51,15.19 v24.68,15.03 | U2.2 20.62,13.13 20.77,13.27 | 20.77,13.27 20.9,13.41 | v20.95,13.34 21.13,12.9 20.77,13.27
  other vias: 29.7,16.1 29.7,18.3 29.7,20.6 29.7,22.7 29.7,24.9 29.7,27.3 29.7,29.5 29.7,31.7 29.7,33.9 29.7,36.5 29.7,38.6 29.7,40.6 29.7,42.8 29.7,45.1 29.7,47.2 29.7,49.65 29.7,52.03 29.67,54.56 29.7,56.91 29.73,59.23 29.7,61.51 29.62,64.08 27.22,64.08 24.92,64.08 22.52,64.08 11.2,63.9 6.5,63.9 4.1,63.9 1.5,63.9 1.5,61.8 1.5,59.4 1.5,57.1 1.5,54.7 1.5,52.1 6.3,47.6 6.3,45.2 6.3,42.9 6.3,40.5 6.3,37.9 1.6,49.5 4,49.5 6.3,49.5 0.93,25.06 0.9,22.2 0.9,19.9 0.9,17.5 0.9,14.9 0.9,12.3 0.9,9.4 24.5,1.3 0.98,1.61 6.3,35.6 6.3,33.2 9.01,44.2 13.2,49.3 8.5,46.5 16.51,48.62 13.42,41.27 13.4,39.4 9,41.7 22.24,43.52 18.75,41.42 21.8,41.9 17.1,30.4 13,30.2 19.1,29.4 21.9,22 25.2,21.3 23.9,47.4 23.77,50.3 26.5,51.1 25.56,49.51 10.24,50.4 4,25.16 23.53,8.14 20.12,4.99 12.48,14.44 0.95,6.85 0.95,4.25 26.8,31.24 27.03,24.02 13.8,27.5 12.28,35.47 21.4,30.67 25.69,34.86 24.57,41.29 22.35,50.68 22.43,47.45 25.86,56.54 19.34,56.33 18.17,53.63 11,18.54 19.93,64.08
  pour Top: 0.1,0 30.6,0 30.6,65.1 0.1,65.1
  pour Bottom: 0,0 30.7,0 30.7,65.2 0,65.2
GREEN  (via drill 0.3)
  Top 0.152: v12.65,53.95 11.73,53.95 10.97,54.71 9.91,54.71 5.33,59.28 5.33,59.44 4.88,59.89 4.27,59.89 4.12,60.05 LED1.3
  Bottom 0.152: v12.65,53.95 14.33,55.63 15.85,55.63 16.15,55.93 16.15,56.08 R2.7
LED  (via drill 0.3)
  Top 0.152: v14.48,54.1 14.78,54.1 15.65,55.07 19.91,55.07 21.95,53.03 21.95,52.58 22.55,51.97 22.55,51.94 23.14,51.36 | v26.06,23.77 26.06,25.2 25.32,25.93 25.32,30.79 27.15,32.61 27.15,42.19 23.14,46.2 23.14,51.36 | v23.95,51.82 23.6,51.82 23.14,51.36 | v20.62,49.66 JP2.2
  Bottom 0.152: v14.48,54.1 14.48,54.41 14.63,54.56 14.63,54.86 R2.4 | v26.06,23.77 24.38,22.1 24.38,16.31 24,16.31 23.5,15.8 23.5,14.63 22.96,14.17 20.12,14.17 19.71,14.58 17.96,14.58 17.42,14.05 16.74,14.05 15.85,14.94 15.54,14.94 15.34,15.24 15.34,15.39 15.39,15.54 U1.12 | v20.62,49.66 21.54,50.8 22.58,51.82 v23.95,51.82
MISO  (via drill 0.3)
  Top 0.152: JP3.2 11.12,2.13 10.06,3.2 9.45,3.2 9.09,3.56 9.09,4.55 9.6,5.05 9.6,5.49 10.06,5.94 10.06,6.86 9.8,7.11 9.8,9.47 10.64,10.31 11.07,10.31 11.43,10.67 v11.43,12.34
  Bottom 0.152: U1.16 13.41,15.54 13.41,15.09 13.56,14.94 13.56,14.48 v11.43,12.34
MOSI  (via drill 0.3)
  Top 0.152: v12.65,12.04 12.65,10.36 12.19,9.91 12.19,9.6 12.34,9.45 12.34,8.53 12.19,8.38 12.19,7.82 12.47,7.54 12.47,5 12.34,4.88 12.34,3.05 12.04,2.74 12.19,2.59 12.19,1.68 11.58,1.07 10.21,1.07 9.18,2.1 JP3.1 8.69,2.13
  Bottom 0.152: v12.65,12.04 13.87,13.26 13.87,15.54 U1.15
N$1  (via drill 0.3)
  Top 0.152: LED2.A 26.53,61.35 v26.04,61.42
  Bottom 0.152: R1.1 27.6,61.42 v26.04,61.42 26.47,61.39 R6.1
N$2
  Bottom 0.152: SJ1.1 16.7,24.93 R7.8
N$3  (via drill 0.3)
  Top 0.406: v6.43,26.7 5.49,26.7 X1.3
  Bottom 0.406: U$1.ANT 6.12,26.7 v6.43,26.7
N$4
  Top 0.152: 13.74,2.11 13.74,6.3
N$5
  Bottom 0.152: 13.77,8.99 15.04,7.72 18.01,7.72 18.87,6.86 18.87,6.25
N$7  (via drill 0.3)
  Top 0.152: v12.65,4.29 12.65,4.42 12.34,4.72
  Bottom 0.152: 16.31,6.3 16.2,6.3 14.73,4.83 13.18,4.83 v12.65,4.29
N$10
  Bottom 0.152: U5.9 6.98,17.9 6.76,17.68 SJ5.2
N$11
  Bottom 0.152: 11.18,8.99 11.25,8.99 11.25,6.3
N$14
  Bottom 0.813: 5.66,26.75 6.93,26.75
N$15  (via drill 0.3)
  Top 0.152: v6.27,18.34 v8.74,18.34
  Bottom 0.152: U5.10 6.58,18.65 v6.27,18.34 | v8.74,18.34 9.69,18.34 C8.1
N$16
  Bottom 1.016: 4.12,26.82 4.12,26.8 0.96,26.8 0.96,28.7 4.78,28.7 4.78,30.84 0.99,30.84 0.99,32.97 4.7,32.97 4.7,35.36 0.99,35.36 0.99,37.54 4.7,37.54 4.7,39.88 1.02,39.88 1.02,42.29 4.67,42.29 4.67,44.78 0.91,44.78
N$18  (via drill 0.3)
  Top 0.152: v26.42,60.53 26.81,60.53 LED2.C
  Bottom 0.152: BAT1.1 6.78,52.02 8.18,52.02 9.3,53.15 Q1.2 9.43,54.09 10.19,54.84 10.21,54.84 10.29,54.91 10.29,55.65 12.24,57.61 12.24,59.05 12.65,59.46 25.04,59.49 25.4,59.13 26.16,59.13 26.42,59.38 v26.42,60.53
OUTA  (via drill 0.3)
  Top 0.152: JP1.8 23.89,6.64 20.85,9.68 20.85,10.39 20.32,10.92 17.88,10.92 17.22,10.26 16.41,10.26 v14.35,12.32
  Bottom 0.152: v14.35,12.32 U1.14
PUSH  (via drill 0.3)
  Top 0.152: v25.07,20.22 24.79,20.5 24.79,20.73 24.74,20.78 v19.38,20.78
  Bottom 0.152: U1.1 17.6,20.04 18.19,20.62 18.36,20.62 18.52,20.78 v19.38,20.78 | v25.07,20.22 25.02,20.22 24.69,19.89 24.69,16.33 24.84,16.18 25.32,16.18 25.45,16.05 25.45,14.43 24.87,13.84 22.38,13.84 22.02,13.49 22.02,6.97 JP1.7
RED  (via drill 0.3)
  Top 0.152: v12.9,56.24 12.9,57.53 9.45,61.42 9.45,62.33 8.69,63.09 5.94,63.09 4.88,62.03 4.12,62.03 LED1.1
  Bottom 0.152: v12.9,56.24 14.48,56.24 R2.5
RIRQ  (via drill 0.3)
  Top 0.152: v17.96,21.29 18.87,21.29 v20.3,22.58
  Bottom 0.152: v17.96,21.29 17.55,20.73 16.92,20.73 U1.32 | U$1.IRQ 24.08,36.58 23.16,36.58 20.83,34.24 20.45,34.24 18.62,32.41 18.62,31.75 20.3,30.1 v20.3,22.58
RSCK  (via drill 0.3)
  Top 0.152: v18.92,19.94 17.42,19.94 16,21.34 16,26.52 v17.68,28.19
  Bottom 0.152: v18.92,19.94 17.98,19.36 17.68,19.36 U1.2 | v17.68,28.19 9.3,36.58 8.23,36.58 U$1.SCK
RSDI  (via drill 0.3)
  Top 0.152: v18.52,15.32 18.39,15.24 16.76,15.24 16.46,14.94 16.46,14.33 17.68,13.11 19.23,13.11 20.07,12.27 21.72,12.27 22,11.99 22,9.42 22.61,8.81 25.04,8.81 25.55,9.32 25.55,14.1 25.78,14.33 25.78,16.13 v23.77,18.14
  Bottom 0.152: v18.52,15.32 18.26,15.52 17.02,15.52 16.92,15.54 U1.9 | U$1.SDI 8.23,34.59 8.38,34.44 10.52,34.44 19.51,25.45 19.51,22.53 22.25,19.68 22.61,19.25 23.5,19.25 23.77,18.87 v23.77,18.14
RSDO  (via drill 0.3)
  Top 0.152: v17.07,14.63 18.97,14.63 20,13.6 20,12.92 20.32,12.6 21.51,12.6 21.79,12.88 21.79,13.59 22.04,13.84 24.59,13.84 25.04,14.3 25.09,14.3 25.45,14.66 25.45,15.98 23.9,17.53 23.47,17.53 23.16,17.84 v23.16,19.84
  Bottom 0.152: v17.07,14.63 16.76,14.94 16.61,14.94 16.36,15.16 16.36,15.62 U1.10 | 24.23,38.56 U$1.SDO 24.67,38.23 25.35,38.23 25.7,37.87 25.7,36.02 25.38,35.69 23.52,35.69 23.16,35.33 v23.16,19.84
RSEL  (via drill 0.3)
  Top 0.152: v13.26,21.64 13.26,22.25 9.63,25.91 9.63,26.59 9.96,26.9 9.96,37.44 9.63,37.69 v9.63,38.1
  Bottom 0.152: v13.26,21.64 13.87,21.03 13.87,20.73 U1.26 | v9.63,38.1 9.3,38.41 8.38,38.41 8.23,38.56 U$1.SEL
RST  (via drill 0.3)
  Top 0.152: v16.92,22.86 19.66,22.86 19.96,23.16 25.76,23.16 28.35,20.57 28.35,15.9 27.99,15.54 27.99,14.83 28.35,14.48 28.35,6.71 27.84,6.2 26.16,6.2 24.74,4.78 23.7,4.78 23.11,4.19 23.11,1.47 21.95,0.3 18.29,0.3 16.61,1.98 16.31,1.98 JP3.4 16.15,1.98 15.24,1.07 14.94,1.07 14.17,0.3 4.27,0.3 v3.66,0.91
  Bottom 0.152: 15.7,22.55 15.7,21.34 15.39,21.03 15.39,20.73 U1.29 | 15.7,22.55 16.61,22.55 v16.92,22.86 | 15.7,22.55 R7.1 | v3.66,0.91 2.74,1.83 2.44,1.83 SW1.1
RXD  (via drill 0.3)
  Top 0.152: v15.6,53.77 16.54,54.71 19.81,54.71 21.64,52.88 21.64,48.97 | 21.64,48.97 21.64,47.24 26.82,42.06 26.82,32.77 v17.53,23.47 | v24.08,48.9 24.43,49.25 24.43,50.83 24.79,51.18 25.3,51.18 27.28,53.16 27.28,57.25 26.34,58.19 26.34,58.22 25.62,58.94 | v22.35,48.92 21.69,48.92 21.64,48.97 | SW5.2 23.93,60.62 25.62,58.94 | v24.92,58.42 25.09,58.42 25.62,58.94
  Bottom 0.152: v15.6,53.77 15.42,54.05 15.39,54.86 R2.3 | v17.53,23.47 17.53,22.55 17.22,22.25 16.31,22.25 16,21.95 16,21.18 15.85,21.03 15.85,20.73 U1.30 | v24.08,48.9 22.38,48.9 v22.35,48.92 | D4.1 24.92,58.38 v24.92,58.42
SCK
  Bottom 0.152: U1.17 12.5,16.31 12.5,15.54 9.98,13.01 9.98,10.92 9.7,10.67 9.7,10.01 9.45,9.75 9.45,7.47 10.06,6.86 10.06,5.94 9.6,5.49 9.6,5.33 11.28,3.66 12.19,3.66 13.72,2.13 JP3.3
SCL  (via drill 0.3)
  Top 0.152: v16.71,11.89 16.89,12.06 16.89,12.78 16.59,13.08 v16.43,13.08 15.82,13.08 14.25,14.66 14.25,17.09 14.99,17.83 18.9,17.83 19.51,18.44 19.51,18.77 20.27,19.53 20.9,19.53 v20.98,19.61 | v11.51,4.45 10.39,4.45 v9.88,3.94
  Bottom 0.152: R7.2 14.94,22.55 14.94,21.79 14.78,21.64 14.78,20.73 U1.28 | R7.2 14.94,22.71 14.94,22.86 15.24,23.16 15.85,23.16 16.76,24.08 17.83,24.08 19.2,22.71 19.2,22.28 20.98,20.5 v20.98,19.61 | v16.43,13.08 16.86,13.51 17.37,13.51 17.93,14.07 19.22,14.07 U2.1 | v16.71,11.89 16.71,10.9 16.15,10.34 14.76,10.34 13.87,9.45 13.87,9.14 CN1.2 13.74,8.79 12.47,7.52 12.47,5.41 v11.51,4.45 | v9.88,3.94 5.38,3.94 3.68,5.64 3.68,9.65 4.14,10.11 U4.SCK | U5.23 7.38,24.4 8.56,25.58 8.94,25.58 9.22,25.86 9.22,27.64 9.8,28.22 12.42,28.22 12.85,27.79 12.85,26.16 12.7,26.01 12.7,25.43 12.68,25.4 12.68,23.42 12.93,23.16 14.43,23.16 14.8,22.79 R7.2
SDA  (via drill 0.3)
  Top 0.152: v14.17,21.64 14.17,19.96 10.97,16.76 10.97,13.72 12.04,12.65 12.04,10.21 11.28,9.45 11.28,9.14 CN1.1 | v8.94,10.49 10.16,10.49 v10.64,10.95 10.06,11.53 10.06,15.88 9.75,16.18 2.72,16.18 1.63,17.27 1.63,18.75 2.03,19.15 4.6,19.15 5.21,19.76 5.21,23.62 5.56,23.98 v8.31,23.98
  Bottom 0.152: 14.02,21.64 14.33,21.34 14.33,20.73 U1.27 | 14.02,21.64 13.87,21.79 13.87,22.55 R7.3 | v14.17,21.64 14.02,21.64 | CN1.1 12.44,10.24 12.55,10.24 | 12.55,10.24 13.59,10.24 14.02,10.67 15.37,10.67 15.82,11.12 15.82,11.84 16.46,12.47 16.89,12.47 17.3,12.88 17.3,12.98 17.95,13.63 U2.6 | U4.DATA 8.57,10.12 v8.94,10.49 | v10.64,10.95 11.84,10.95 12.55,10.24 | U5.24 7.78,23.45 v8.31,23.98
TXD  (via drill 0.3)
  Top 0.152: v16.76,53.75 17.09,53.75 17.65,54.36 19.68,54.36 21.34,52.73 21.34,48.56 | 21.34,48.56 21.34,47.09 26.52,41.91 26.52,33.38 16.31,23.16 16.31,21.95 v16.61,21.64 | SW2.2 9.53,54.08 10.31,53.29 13.72,53.29 18.09,48.92 18.09,48.46 | v20.55,48.51 21.29,48.51 21.34,48.56 | 18.14,48.51 18.09,48.46 | v18.09,48.49 18.21,48.34 18.09,48.46
  Bottom 0.152: v16.76,53.75 16.75,53.66 | 16.75,53.66 16.15,54.33 16.15,54.86 R2.2 | v16.61,21.64 16.61,21.34 16.31,21.03 16.31,20.73 U1.31 | v20.55,48.51 18.82,48.51 v18.09,48.49 | D4.2 23.35,56.48 22.33,57.51 22.33,58.22 21.67,58.88 20.09,58.88 17.88,56.67 17.88,54.46 16.75,53.66
USB_D+  (via drill 0.3)
  Top 0.152: v29.08,15.19 29.08,15.52 28.88,15.72 28.85,26.7 28.25,27.3 27.08,27.3 v26.54,27.46
  Bottom 0.152: J3.D+ 27.21,5.7 27.56,6.04 27.56,10.97 27.94,11.35 27.94,13.97 28.55,14.58 28.93,14.58 29.08,14.73 v29.08,15.19 28.98,15.09 | D2.C 26.49,27.36 | 26.49,27.36 26.49,28.18 R3.1 | v26.54,27.46 26.49,27.36
USB_D-
  Bottom 0.152: J3.D- 25.55,6.35 25.25,6.66 25.25,7.49 26.21,8.46 26.21,14.02 25.83,14.4 25.83,16.28 25.22,16.89 25.22,18.44 25.04,18.62 25.04,18.9 26.09,19.94 26.44,19.94 26.82,20.32 26.82,22 27.41,22.58 27.65,22.58 D1.C 28.16,24.69 R4.1
XTAL1  (1 unrouted)
  Bottom 0.152: C9.1 22.29,18.22 21.86,17.8 | U1.7 18.88,16.85 19.83,17.8
XTAL2  (1 unrouted)
  Bottom 0.152: C7.1 22.07,15.19 21.86,15.4 | U1.8 18.88,16.35 19.83,15.4
(copper drawn outside any net)
  shapes: Bottom area x1

### Text on the board
tPlace: Charging | GND | SDA | MOSI | GND
bPlace: DotControl / v0.1.4 | Mihai Galos / 12.2017